# EasyEDA schematic SMT-PBTSv1.4_Schematic.json
TITLE: SMT-PBTS; REV: 1.4; Date: 2020-07-19; Sheet: 1/1; Drawn By: DaGoose; Company: DaGoose
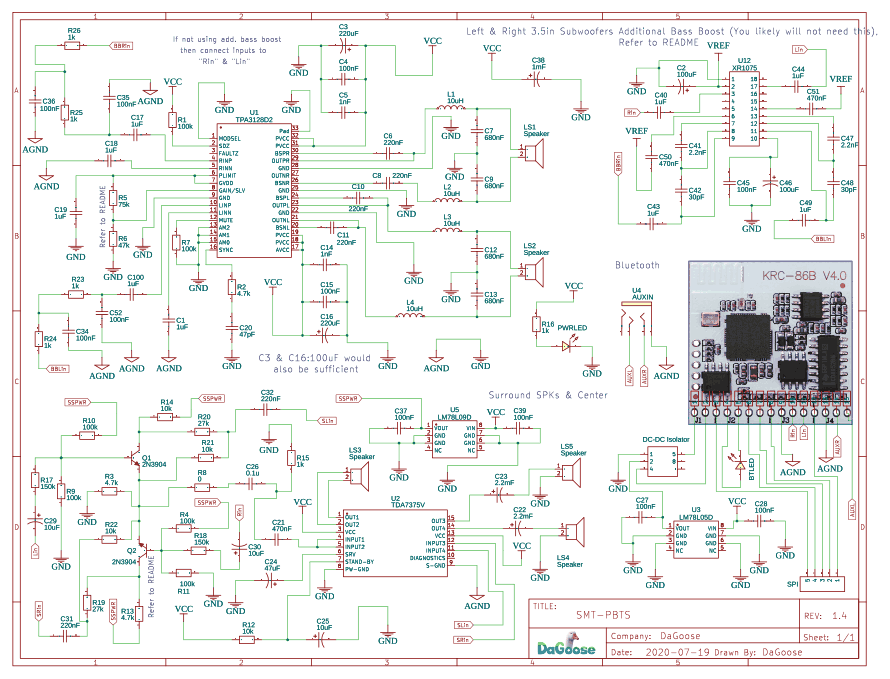
[diagram p0: schematic sheet]

## Parts
BTLED  LED-0603_R  [LED0603_RED]
C1  1uF  [C0603]
C2  100uF  [CASE-A_3216]
C3  220uF  [CASE-A_3216]
C4  100nF  [C0603]
C5  1nF  [C0603]
C6  220nF  [C0603]
C7  680nF  [C0603]
C8  220nF  [C0603]
C9  680nF  [C0603]
C10  220nF  [C0603]
C11  220nF  [C0603]
C12  680nF  [C0603]
C13  680nF  [C0603]
C14  1nF  [C0603]
C15  100nF  [C0603]
C16  220uF  [CASE-A_3216]
C17  1uF  [C0603]
C18  1uF  [C0603]
C19  1uF  [C0603]
C20  47pF  [C0603]
C21  470nF  [C0603]
C22  2.2mF  [CASE-A_3216]
C23  2.2mF  [CASE-A_3216]
C24  47uF  [CASE-A_3216]
C25  10uF  [CASE-A_3216]
C26  0.1u  [C0603]
C27  100nF  [C0603]
C28  100nF  [C0603]
C29  10uF  [CASE-A_3216]
C30  10uF  [CASE-A_3216]
C31  220nF  [C0603]
C32  220nF  [C0603]
C34  100nF  [C0603]
C35  100nF  [C0603]
C36  100nF  [C0603]
C37  100nF  [C0603]
C38  1mF  [CASE-A_3216]
C39  100nF  [C0603]
C40  1uF  [C0603]
C41  2.2nF  [C0603]
C42  30pF  [C0603]
C43  1uF  [C0603]
C44  1uF  [C0603]
C45  100nF  [C0603]
C46  100uF  [CASE-A_3216]
C47  2.2nF  [C0603]
C48  30pF  [C0603]
C49  1uF  [C0603]
C50  470nF  [C0603]
C51  470nF  [C0603]
C52  100nF  [C0603]
C100  1uF  [C0603]
H1  SPI  [HDR-F-2.54_1X5]
J1  HDR-M-2.54_1x1  [HDR-M-2.54_1X1]
J2  HDR-M-2.54_1x1  [HDR-M-2.54_1X1]
J3  HDR-M-2.54_1x1  [HDR-M-2.54_1X1]
J4  HDR-M-2.54_1x1  [HDR-M-2.54_1X1]
J5  HDR-M-2.54_1x1  [HDR-M-2.54_1X1]
J6  HDR-M-2.54_1x1  [HDR-M-2.54_1X1]
J7  HDR-M-2.54_1x1  [HDR-M-2.54_1X1]
J8  HDR-M-2.54_1x1  [HDR-M-2.54_1X1]
J9  HDR-M-2.54_1x1  [HDR-M-2.54_1X1]
J10  HDR-M-2.54_1x1  [HDR-M-2.54_1X1]
J11  HDR-M-2.54_1x1  [HDR-M-2.54_1X1]
J12  HDR-M-2.54_1x1  [HDR-M-2.54_1X1]
J13  HDR-M-2.54_1x1  [HDR-M-2.54_1X1]
J14  HDR-M-2.54_1x1  [HDR-M-2.54_1X1]
J15  HDR-M-2.54_1x1  [HDR-M-2.54_1X1]
L1  10uH  [L0603]
L2  10uH  [L0603]
L3  10uH  [L0603]
L4  10uH  [L0603]
LS1  Speaker
LS2  Speaker
LS3  Speaker
LS4  Speaker
LS5  Speaker
P1  DC-DC Isolator  [IDC-TH_6P-P2.54_C11214]
PWRLED  LED-0603_R  [LED0603_RED]
Q1  2N3904  [SOT-23-3_L2.9-W1.3-P1.90-LS2.4-TR]
Q2  2N3904  [SOT-23-3_L2.9-W1.3-P1.90-LS2.4-TR]
R1  100k  [R0201]
R2  4.7k  [R0201]
R3  4.7k  [R0603]
R4  100k  [R0603]
R5  75k  [R0603]
R6  47k  [R0603]
R7  100k  [R0603]
R8  0  [R0603]
R9  100k  [R0603]
R10  100k  [R0603]
R11  100k  [R0603]
R12  10k  [R0603]
R13  4.7k  [R0603]
R14  10k  [R0603]
R15  1k  [R0603]
R16  1k  [R0603]
R17  150k  [R0603]
R18  150k  [R0603]
R19  27k  [R0603]
R20  27k  [R0603]
R21  10k  [R0603]
R22  10k  [R0603]
R23  1k  [R0603]
R24  1k  [R0603]
R25  1k  [R0603]
R26  1k  [R0603]
U1  TPA3128D2  [HTSSOP-32_L11.0-W6.1-P0.65-LS8.1-BL-EP]
U2  TDA7375V  [MULTIWATT-15_L19.6-W5.0-P1.27-L]
U3  LM78L05D  [SOP-8_L5.0-W4.0-P1.27-LS6.0-BL]
U4  AUXIN  [AUDIO-JACK-TRRS-SMD]
U5  LM78L09D  [SOP-8_L5.0-W4.0-P1.27-LS6.0-BL]
U12  XR1075  [IDC-TH_18P-P2.54-V-R2-C9-S2.54]

## Library data of the parts
BTLED PWRLED = LED-0603_R: Manufacturer: EVERLIGHT(台湾亿光); Manufacturer Part: 19-217/R6C-AL1M2VY/3T; Supplier Part: C72044; Supplier: LCSC; Contributor: LCEDA_01
C1 C4-C15 C17-C21 C26-C28 C31 C32 C34-C37 C39-C45 C47-C52 C100 = C_0603_US: Contributor: LCEDA_Lib
C2 C3 C16 C22-C25 C29 C30 C38 C46 = C_Tan_SMD_A_US: Contributor: LCEDA_Lib
H1 = HDR-F-2.54_1x5: Supplier Part: C50950; Supplier: LCSC; Contributor: LCEDA_Lib
J1-J15 = HDR-M-2.54_1x1: Supplier Part: C81276; Supplier: LCSC; Contributor: LCEDA_Lib
L1-L4 = L0603_US: Contributor: LCEDA_Lib
LS1-LS5 = Speaker: Contributor: KiCAD; license: https://www.gnu.org/licenses/lgpl-2.1.html
P1 = HDR-IDC-2.54-2X3P: Supplier: LCSC; Manufacturer: BOOMELE; Manufacturer Part: 2X3 2.54mm IDC Box; image: //image.lceda.cn/szlcsc/C11214.jpg; Supplier Part: C11214
Q1 Q2 = 2N3904(SOT-23): Supplier: LCSC; Manufacturer: KEC; Manufacturer Part: 2n3904S-RTK/PS; Supplier Part: C18536; SMT Type: SOT-23; Contributor: LCEDA_Lib
R1 R2 = R_0201_EU: Contributor: LCEDA_Lib
R3-R26 = R_0603_EU: Contributor: LCEDA_Lib
U1 = TPA3128D2DAPR: Supplier: LCSC; Supplier Part: C473362; Manufacturer: Texas Instruments; Contributor: LCSC
U2 = E-TDA7375V: Supplier: LCSC; Supplier Part: C262883; Manufacturer: STMicroelectronics; Contributor: LCSC
U3 U5 = LM78L05D: Supplier: LCSC; Supplier Part: C596351; Manufacturer: HTC Korea TAEJIN Tech; Contributor: LCSC
U4 = AUDIO-JACK3: Contributor: SparkFun
U12 = HDR-IDC-2.54-2X9P: Supplier: LCSC; Manufacturer: BOOMELE; Manufacturer Part: 2X9 2.54mm IDC Box; image: //image.lceda.cn/szlcsc/C11216.jpg; Supplier Part: C11216

## Nets
AGND: C1.1 C2.2 C3.2 C4.1 C5.1 C7.1 C9.2 C12.1 C13.2 C14.2 C15.2 C16.2 C18.1 C19.1 C20.1 C24.2 C25.2 C27.1 C28.2 C34.1 C35.2 C36.1 C37.1 C38.2 C39.2 C45.1 C46.2 C52.1 J9.1(9) J13.1(13) LS4.2 LS5.2 P1.1 PWRLED.2 R3.2 R6.1 R7.1 R9.1 R11.2 R15.2 U1.1(MODSEL) U1.9(GND) U1.13(AM2) U1.14(AM1) U1.15(AM0) U1.22(GND) U1.25(GND) U1.28(GND) U1.33(Pad) U2.8(PW-GND) U2.9(S-GND) U3.2(GND) U3.3(GND) U3.6(GND) U3.7(GND) U4.EARTH U5.2(GND) U5.3(GND) U5.6(GND) U5.7(GND) U12.1
VCC: C3.1 C4.2 C5.2 C14.1 C15.1 C16.1 C28.1 C38.1 C39.1 R1.2 R12.1 R16.2 U1.17(AVCC) U1.18(PVCC) U1.19(PVCC) U1.31(PVCC) U1.32(PVCC) U2.3(VCC) U2.13(VCC) U3.8(VIN) U5.8(VIN)
AUXL: J15.1(15) U4.TIP
AUXR: J14.1(14) U4.RING1
BBLin: C49.2 R24.1
BBRin: C43.2 R26.2
Lin: C29.2 C44.2 J11.1(11)
Rin: C30.2 C40.1 J10.1(10)
SLin: C32.2 U2.11(INPUT4)
SRin: C31.1 U2.12(INPUT3)
SSPWR: C37.2 R4.2 R10.2 R13.1 R14.2 U5.1(VOUT)
VREF: C2.1 C50.1 C51.2 U12.3(2)
Net-(BTLED-1): BTLED.1 J4.1(4)
Net-(BTLED-2): BTLED.2 J5.1(5)
Net-(C1-2): C1.2 U1.11(LINN)
Net-(C6-1): C6.1 U1.30(BSPR)
Net-(C6-2): C6.2 L1.1 U1.29(OUTPR)
Net-(C7-2): C7.2 L1.2 LS1.1
Net-(C8-1): C8.1 U1.26(BSNR)
Net-(C8-2): C8.2 L2.1
Net-(C9-1): C9.1 L2.2 LS1.2
Net-(C10-1): C10.1 U1.24(BSPL)
Net-(C10-2): C10.2 L3.1 U1.23(OUTPL)
Net-(C11-1): C11.1 U1.20(BSNL)
Net-(C11-2): C11.2 L4.1 U1.21(OUTNL)
Net-(C12-2): C12.2 L3.2 LS2.1
Net-(C13-1): C13.1 L4.2 LS2.2
Net-(C17-1): C17.1 C35.1 R25.1
Net-(C17-2): C17.2 U1.4(RINP)
Net-(C18-2): C18.2 U1.5(RINN)
Net-(C19-2): C19.2 R5.2 U1.6(PLIMIT) U1.7(GVDD)
Net-(C20-2): C20.2 R2.1
Net-(C21-1): C21.1 C26.2 R15.1
Net-(C21-2): C21.2 U2.4(INPUT1) U2.5(INPUT2)
Net-(C22-1): C22.1 U2.14(OUT4)
Net-(C22-2): C22.2 LS4.1
Net-(C23-1): C23.1 U2.15(OUT3)
Net-(C23-2): C23.2 LS5.1
Net-(C24-1): C24.1 U2.6(SRV)
Net-(C25-1): C25.1 R12.2 U2.7(STAND-BY)
Net-(C26-1): C26.1 R8.2
Net-(C27-2): C27.2 P1.3(2) U3.1(VOUT)
Net-(C29-1): C29.1 R17.1
Net-(C30-1): C30.1 R18.2
Net-(C31-2): C31.2 R19.1 R22.1
Net-(C32-1): C32.1 R20.2 R21.2
Net-(C34-2): C34.2 R23.1 R24.2
Net-(C36-2): C36.2 R25.2 R26.1
Net-(C40-2): C40.2 U12.5(3)
Net-(C41-1): C41.1 C42.2 U12.15(8)
Net-(C41-2): C41.2 U12.13(7)
Net-(C42-1): C42.1 C43.1 U12.17(9)
Net-(C44-1): C44.1 U12.4(17)
Net-(C45-2): C45.2 C46.1 U12.18(10)
Net-(C47-1): C47.1 C48.2 U12.14(12)
Net-(C47-2): C47.2 U12.12(13)
Net-(C48-1): C48.1 C49.1 U12.16(11)
Net-(C50-2): C50.2 U12.11(6)
Net-(C51-1): C51.1 U12.10(14)
Net-(C52-2): C52.2 C100.1 R23.2
Net-(C100-2): C100.2 U1.10(LINP)
Net-(H1-1): H1.1 J12.1(12)
Net-(H1-2): H1.2 J8.1(8)
Net-(H1-3): H1.3 J7.1(7)
Net-(H1-4): H1.4 J6.1(6)
Net-(H1-5): H1.5 J3.1(3)
Net-(J1-1): J1.1 P1.2(5)
Net-(J2-1): J2.1(2) P1.5(4)
Net-(LS3-1): LS3.1 U2.2(OUT2)
Net-(LS3-2): LS3.2 U2.1(OUT1)
Net-(PWRLED-1): PWRLED.1 R16.1
Net-(Q1-1): Q1.1(E) Q2.1(E) R3.1 R8.1 R21.1 R22.2
Net-(Q1-2): Q1.2(B) R9.2 R10.1 R17.2
Net-(Q1-3): Q1.3(C) R14.1 R20.1
Net-(Q2-2): Q2.2(B) R4.1 R11.1 R18.1
Net-(Q2-3): Q2.3(C) R13.2 R19.2
Net-(R1-1): R1.1 U1.2(SDZ)
Net-(R2-2): R2.2 U1.16(SYNC)
Net-(R5-1): R5.1 R6.2 U1.8(GAIN/SLV)
Net-(R7-2): R7.2 U1.12(MUTE)

Not connected (* = marked no-connect by the designer): P1 4(8) 6; U1 3(FAULTZ) 27(OUTNR); U2 10(DIAGNOSTICS); U3 4(NC) 5(NC); U4 RING2; U5 4(NC) 5(NC); U12 2(18) 6(16) 7(4) 8(15) 9(5)

## Notes on the sheet
- Left & Right 3.5in Subwoofers
- Additional Bass Boost (You likely will not need this),
- If not using add. bass boost
- Refer to README
- then connect inputs to
- "Rin" & "Lin"
- Refer to README
- Bluetooth
- C3 & C16:100uF would
- also be sufficient
- Surround SPKs & Center
- Refer to README
